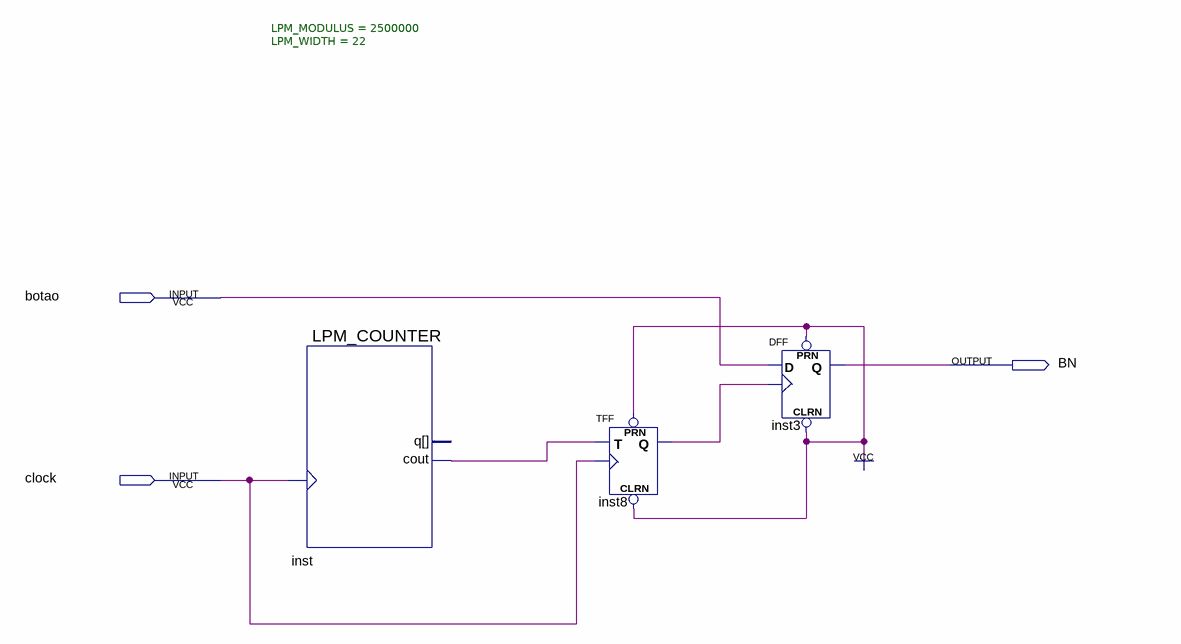
[diagram p0: schematic sheet]
// Quartus schematic Debounce.bdf as structural Verilog: 3 symbols, 3 pins
module Debounce (
  input  botao,
  input  clock,
  output BN
);

  wire inst8_q, inst_cout;

  LPM_COUNTER #(.LPM_MODULUS(2500000), .LPM_WIDTH(22)) inst (.clock(clock), .cout(inst_cout));  // open: q
  TFF inst8 (.PRN(1'b1), .CLRN(1'b1), .T(inst_cout), .CLK(clock), .Q(inst8_q));
  DFF inst3 (.CLRN(1'b1), .CLK(inst8_q), .D(botao), .PRN(1'b1), .Q(BN));
endmodule
